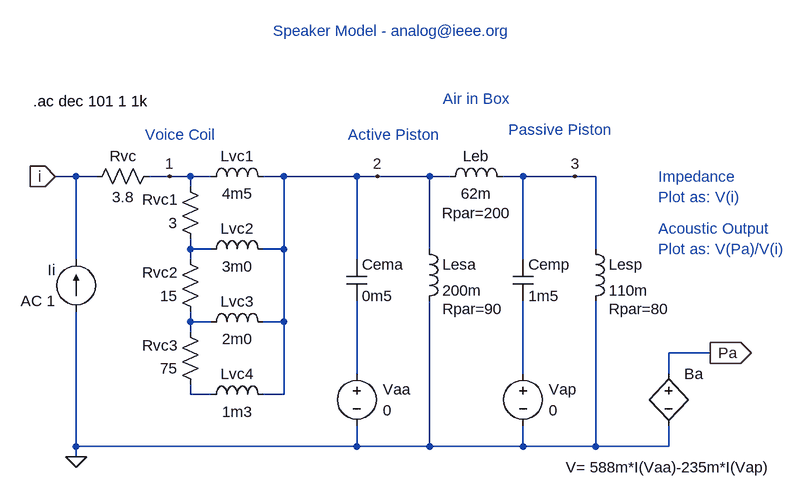
[diagram p0: schematic Speaker_Model.asc]
Speaker_Model.asc, the LTspice schematic file:
Version 4
SHEET 1 1536 680
WIRE 384 368 272 368
WIRE -416 368 -416 160
WIRE -416 80 -416 -48
WIRE -448 -48 -416 -48
WIRE -304 -48 -272 -48
WIRE -128 -48 -96 -48
WIRE 240 -48 272 -48
WIRE 384 -48 384 64
WIRE 384 144 384 368
WIRE -240 -48 -240 -32
WIRE -240 48 -240 64
WIRE -240 160 -240 176
WIRE -240 272 -240 288
WIRE -240 -48 -208 -48
WIRE -240 288 -208 288
WIRE 16 368 -416 368
WIRE -96 288 -96 176
WIRE -96 -48 16 -48
WIRE -96 64 -128 64
WIRE -208 64 -240 64
WIRE -240 64 -240 80
WIRE -96 64 -96 -48
WIRE -96 176 -128 176
WIRE -208 176 -240 176
WIRE -240 176 -240 192
WIRE -96 176 -96 64
WIRE 16 -48 16 80
WIRE 16 144 16 256
WIRE 16 -48 48 -48
WIRE 272 368 128 368
WIRE 272 -48 272 80
WIRE 272 144 272 256
WIRE 272 -48 352 -48
WIRE 496 224 560 224
WIRE -128 288 -96 288
WIRE 128 -48 128 64
WIRE 128 144 128 368
WIRE 128 -48 160 -48
WIRE 128 368 16 368
WIRE 16 336 16 368
WIRE 272 336 272 368
WIRE 496 256 496 224
WIRE -416 384 -416 368
WIRE 384 368 496 368
WIRE 496 336 496 368
WIRE -272 -48 -240 -48
WIRE 48 -48 128 -48
WIRE 352 -48 384 -48
WIRE -416 -48 -384 -48
FLAG 560 224 Pa
IOPIN 560 224 Out
FLAG -416 384 0
FLAG -448 -48 i
IOPIN -448 -48 In
FLAG -272 -48 1
FLAG 48 -48 2
FLAG 352 -48 3
SYMBOL res -224 64 R180
WINDOW 0 36 76 Left 0
WINDOW 3 36 40 Left 0
SYMATTR InstName Rvc1
SYMATTR Value 3
SYMBOL res -224 176 R180
WINDOW 0 36 76 Left 0
WINDOW 3 36 40 Left 0
SYMATTR InstName Rvc2
SYMATTR Value 15
SYMBOL res -224 288 R180
WINDOW 0 36 76 Left 0
WINDOW 3 36 40 Left 0
SYMATTR InstName Rvc3
SYMATTR Value 75
SYMBOL res -288 -64 R90
WINDOW 0 0 56 VBottom 0
WINDOW 3 32 56 VTop 0
SYMATTR InstName Rvc
SYMATTR Value 3.8
SYMBOL ind -224 -32 R270
WINDOW 0 32 56 VTop 0
WINDOW 3 5 56 VBottom 0
SYMATTR InstName Lvc1
SYMATTR Value 4m5
SYMBOL ind -224 80 R270
WINDOW 0 32 56 VTop 0
WINDOW 3 5 56 VBottom 0
SYMATTR InstName Lvc2
SYMATTR Value 3m0
SYMBOL ind -224 192 R270
WINDOW 0 32 56 VTop 0
WINDOW 3 5 56 VBottom 0
SYMATTR InstName Lvc3
SYMATTR Value 2m0
SYMBOL ind 144 -32 R270
WINDOW 0 32 56 VTop 0
WINDOW 3 5 56 VBottom 0
WINDOW 39 -25 57 VBottom 0
SYMATTR InstName Leb
SYMATTR Value 62m
SYMATTR SpiceLine Rpar=200
SYMBOL current -416 160 R180
WINDOW 0 32 64 Left 0
WINDOW 3 24 0 Left 0
WINDOW 123 32 16 Left 0
WINDOW 39 0 0 Left 0
SYMATTR InstName Ii
SYMATTR Value ""
SYMATTR Value2 AC 1
SYMBOL cap 0 80 R0
SYMATTR InstName Cema
SYMATTR Value 0m5
SYMBOL ind 112 48 R0
WINDOW 39 36 108 Left 0
SYMATTR InstName Lesa
SYMATTR Value 200m
SYMATTR SpiceLine Rpar=90
SYMBOL ind 368 48 R0
WINDOW 39 36 108 Left 0
SYMATTR SpiceLine Rpar=80
SYMATTR InstName Lesp
SYMATTR Value 110m
SYMBOL cap 256 80 R0
SYMATTR InstName Cemp
SYMATTR Value 1m5
SYMBOL ind -224 304 R270
WINDOW 0 32 56 VTop 0
WINDOW 3 5 56 VBottom 0
SYMATTR InstName Lvc4
SYMATTR Value 1m3
SYMBOL voltage 16 240 R0
WINDOW 0 40 40 Left 0
WINDOW 3 40 72 Left 0
SYMATTR InstName Vaa
SYMATTR Value 0
SYMBOL voltage 272 240 R0
WINDOW 0 40 40 Left 0
WINDOW 3 40 72 Left 0
SYMATTR InstName Vap
SYMATTR Value 0
SYMBOL bv 496 240 R0
WINDOW 3 0 160 Center 0
SYMATTR InstName Ba
SYMATTR Value V= 588m*I(Vaa)-235m*I(Vap)
TEXT 480 64 Left 0 ;Plot as: V(Pa)/V(i)
TEXT 480 32 Left 0 ;Acoustic Output
TEXT -256 -112 Center 0 ;Voice Coil
TEXT 200 -168 Center 0 ;Air in Box
TEXT 328 -120 Center 0 ;Passive Piston
TEXT 72 -112 Center 0 ;Active Piston
TEXT -482 -164 Left 0 !.ac dec 101 1 1k
TEXT 72 -272 Center 0 ;Speaker Model - analog@ieee.org
TEXT 480 -48 Left 0 ;Impedance
TEXT 480 -16 Left 0 ;Plot as: V(i)

The netlist it stands for:
* Speaker_Model.asc
Rvc1 N001 1 3
Rvc2 N002 N001 15
Rvc3 N003 N002 75
Rvc 1 i 3.8
Lvc1 1 2 4m5
Lvc2 N001 2 3m0
Lvc3 N002 2 2m0
Leb 2 3 62m Rpar=200
Ii 0 i AC 1
Cema 2 N004 0m5
Lesa 2 0 200m Rpar=90
Lesp 3 0 110m Rpar=80
Cemp 3 N005 1m5
Lvc4 N003 2 1m3
Vaa N004 0 0
Vap N005 0 0
Ba Pa 0 V= 588m*I(Vaa)-235m*I(Vap)
* Plot as: V(Pa)/V(i)
* Acoustic Output
* Voice Coil
* Air in Box
* Passive Piston
* Active Piston
.ac dec 101 1 1k
* Speaker Model - analog@ieee.org
* Impedance
* Plot as: V(i)
.backanno
.end